# EasyEDA Pro project Jalousee PCB.eprj, schematic Jalousee PCB TC118S_5V_1
Create Date: 2023-09-13; Page Name: P2; Project Name: Jalousee PCB; Schematic Name: Jalousee PCB TC118S_5V_1; Update Date: 2023-09-13; Company: EasyEDA.com; Drawed: EasyEDA Pro; Page Size: A4; Part Number: JLCPCB-002; Reviewed: EasyEDA Pro; Version: V0.1
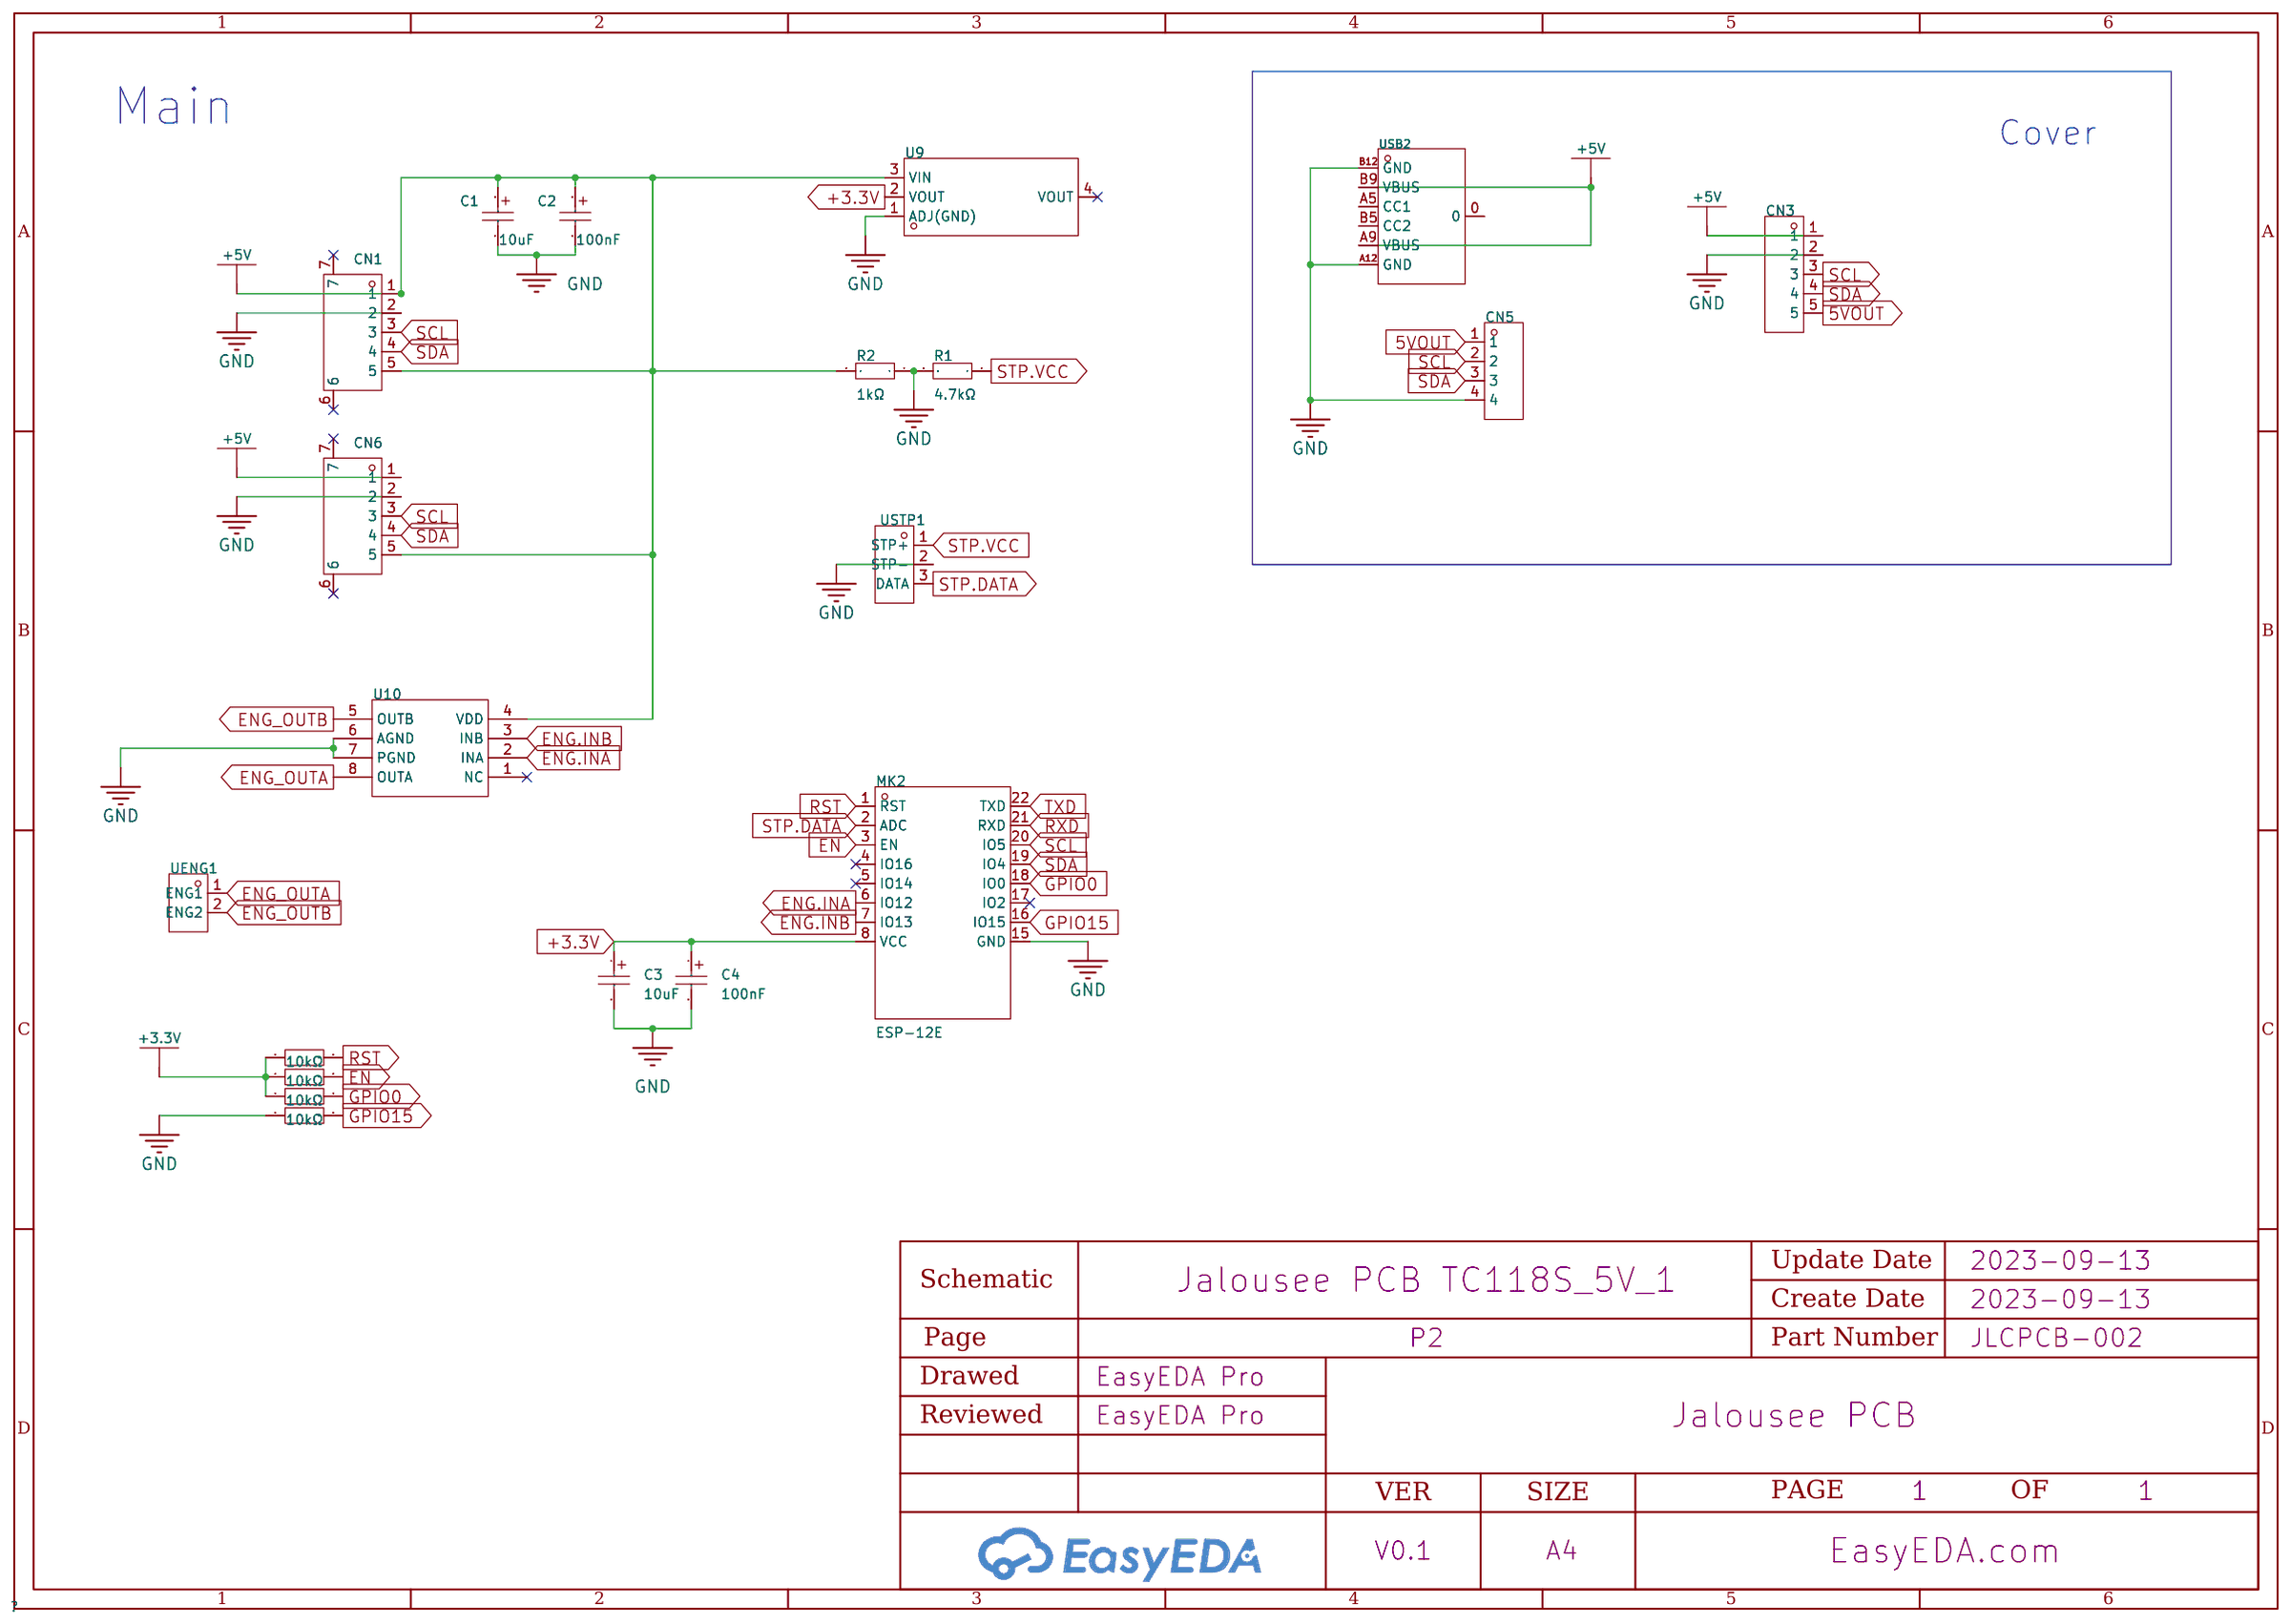
[diagram p6: schematic sheet]

## Parts
C1  10uF  [CASE-A_3216]
C2  100nF  [CASE-A_3216]
C3  10uF  [CASE-A_3216]
C4  100nF  [CASE-A_3216]
CN1  HC-1.25-5PWT  [CONN-SMD_5P-P1.25_HCTL_HC-1.25-5PWT]
CN3  HC-1.25-5A  [CONN-TH_5P-P1.25_HCTL_HC-1.25-5A]
CN5  HC-1.25-4AW  [CONN-TH_4P-P1.25_HCTL_HC-1.25-4AW]
CN6  HC-1.25-5PWT  [CONN-SMD_5P-P1.25_HCTL_HC-1.25-5PWT]
MK2  ESP-12E  [WIFIM-SMD_ESP-12E-BR]
R1  4.7kΩ  [R0603]
R2  1kΩ  [R0603]
R4  10kΩ  [R0603]
R5  10kΩ  [R0603]
R6  10kΩ  [R0603]
R7  10kΩ  [R0603]
U9  -  [SOT-223-3_L6.5-W3.4-P2.30-LS7.0-BR]
U10  -  [SOP-8_L4.9-W3.9-P1.27-LS6.0-BL]
UENG1  -  [CONN-TH_2P-P1.25_HCTL_HC-1.25-2A]
USB2  USB-TYPE-C-015  [USB-C-SMD_TYPE-C--015]
USTP1  -  [CONN-TH_3P-P1.25_HCTL_HC-1.25-3A]

## Library data of the parts
C1 C3 = TAJA106K010RNJ: Capacitance: Tolerance:±10% Tolerance:±10% Rated Voltage: Equivalent Series Resistance(ESR):3Ω@100kHz Operating Temperature:-55~+125 Operating Temperature:-55~+125; LCSC Part Name: 10uF ±10% 10V; Supplier Part: C7177; Manufacturer: Kyocera AVX; JLCPCB Part Class: Extended Part; Datasheet: https://atta.szlcsc.com/upload/public/pdf/source/20160107/1457707748330.pdf; Supplier: LCSC; Tolerance: ±10%; Equivalent Series Resistance(ESR): 3Ω@100kHz; Operating Temperature: -55~+125
C2 C4 = TAJA104K035RNJ: Capacitance: Tolerance:±10% Tolerance:±10% Rated Voltage: Equivalent Series Resistance(ESR):24Ω@100kHz Operating Temperature:-55~+125 Operating Temperature:-55~+125; LCSC Part Name: 100nF ±10% 35V; Supplier Part: C7173; Manufacturer: Kyocera AVX; JLCPCB Part Class: Extended Part; Datasheet: https://atta.szlcsc.com/upload/public/pdf/source/20160107/1457707748183.pdf; Supplier: LCSC; Tolerance: ±10%; Equivalent Series Resistance(ESR): 24Ω@100kHz; Operating Temperature: -55~+125
CN1 CN6 = HC-1.25-5PWT: Reference Series:- Pitch:1.25mm Pins Structure:1x5P Number of Rows:1 Number of PINs Per Row:5 Row Spacing:- Gender:公型插针 Mounting Style:Surface Mount Current Rating (Max):1A Operating Temperature Range:-25℃~+85℃ Operating Temperature Range:-25℃~+85℃; LCSC Part Name: 1.25mm 1x5P 卧贴; Supplier Part: C2845382; Manufacturer: HCTL(华灿天禄); Supplier Footprint: SMD,P=1.25mm; JLCPCB Part Class: Extended Part; Datasheet: https://atta.szlcsc.com/upload/public/pdf/source/20210728/C2845379_48B7DC28A4B35DB030A7253F7C3FD974.pdf; Supplier: LCSC; Pitch: 1.25mm; Pins Structure: 1x5P; Number of Rows: 1; Number of PINs Per Row: 5; Gender: 公型插针; Mounting Style: Surface Mount; Current Rating (Max): 1A; Operating Temperature Range: -25℃~+85℃
CN3 = HC-1.25-5A: Reference Series:- Pitch:1.25mm Pins Structure:1x5P Number of Rows:1 Number of PINs Per Row:5 Row Spacing:- Gender:公型插针 Mounting Style:Straight Current Rating (Max):1A Operating Temperature Range:-25℃~+85℃ Operating Temperature Range:-25℃~+85℃; LCSC Part Name: 1.25mm 1x5P 直插; Supplier Part: C2845523; Manufacturer: HCTL(华灿天禄); Supplier Footprint: 直插,P=1.25mm; JLCPCB Part Class: Extended Part; Datasheet: https://atta.szlcsc.com/upload/public/pdf/source/20210729/C2845520_89EAA22C8D4DE2FB8A253230326912FB.pdf; Supplier: LCSC; Pitch: 1.25mm; Pins Structure: 1x5P; Number of Rows: 1; Number of PINs Per Row: 5; Gender: 公型插针; Mounting Style: Straight; Current Rating (Max): 1A; Operating Temperature Range: -25℃~+85℃
CN5 = HC-1.25-4AW: Reference Series:- Pitch:1.25mm Pins Structure:1x4P Number of Rows:1 Number of PINs Per Row:4 Row Spacing:- Gender:公型插针 Mounting Style:Shrouded Current Rating (Max):1A Operating Temperature Range:-25℃~+85℃ Operating Temperature Range:-25℃~+85℃; LCSC Part Name: 1.25mm 1x4P 弯插; Supplier Part: C2845537; Manufacturer: HCTL(华灿天禄); Supplier Footprint: 插件,P=1.25mm; JLCPCB Part Class: Extended Part; Datasheet: https://atta.szlcsc.com/upload/public/pdf/source/20210729/C2845535_17B4C65D5133EDBE0A07B8E05D9E3662.pdf; Supplier: LCSC; Pitch: 1.25mm; Pins Structure: 1x4P; Number of Rows: 1; Number of PINs Per Row: 4; Gender: 公型插针; Mounting Style: Shrouded; Current Rating (Max): 1A; Operating Temperature Range: -25℃~+85℃
MK2 = ESP-12E_C89297: Supplier Part: C89297; Manufacturer: Ai-Thinker(安信可); Supplier Footprint: 无线模块(WIFI); JLCPCB Part Class: Extended Part; Datasheet: https://atta.szlcsc.com/upload/public/pdf/source/20161125/1480068346912.pdf; Supplier: LCSC
R1 = RC0603JR-074K7L: Overload Voltage (Max): Operating Temperature Range: Operating Temperature Range: Body Length:- Tolerance: φD:- Body Height:- Body Width:- Resistance: Type:Thick Film Resistors Temperature Coefficient: Temperature Coefficient: Power(Watts):; LCSC Part Name: 4.7kΩ ±5%; Supplier Part: C105428; Manufacturer: YAGEO(国巨); Supplier Footprint: 0603; JLCPCB Part Class: Extended Part; Datasheet: https://atta.szlcsc.com/upload/public/pdf/source/20170413/1492062713212.pdf; Supplier: LCSC; Type: Thick Film Resistors
R2 = RC0603FR-071KL: Type:Thick Film Resistors Resistance: Tolerance:±1% Tolerance:±1% Power(Watts): Temperature Coefficient:±100ppm/ Temperature Coefficient:±100ppm/ Overload Voltage (Max): Operating Temperature Range:-55~+155 Operating Temperature Range:-55~+155; LCSC Part Name: 1kΩ ±1% 100mW; Supplier Part: C22548; Manufacturer: YAGEO(国巨); Supplier Footprint: 0603; JLCPCB Part Class: Extended Part; Datasheet: https://atta.szlcsc.com/upload/public/pdf/source/20180312/7BD3618A8B6324EA6280B0497A051AB7.pdf; Supplier: LCSC; Type: Thick Film Resistors; Tolerance: ±1%; Temperature Coefficient: ±100ppm/; Operating Temperature Range: -55~+155
R4-R7 = RC0603JR-0710KL: Overload Voltage (Max): Resistance: Body Length:- Tolerance: φD:- Body Height:- Body Width:- Type:Thick Film Resistors Temperature Coefficient: Temperature Coefficient: Operating Temperature Range: Operating Temperature Range: Power(Watts):; LCSC Part Name: 10kΩ ±5%; Supplier Part: C99198; Manufacturer: YAGEO(国巨); Supplier Footprint: 0603; JLCPCB Part Class: Extended Part; Datasheet: https://atta.szlcsc.com/upload/public/pdf/source/20181223/C99198_917934A193F41F77D9F7D214A8C79116.pdf; Supplier: LCSC; Type: Thick Film Resistors
U9 = AMS1117-3.3: Output Type:固定 Output Polarity:正 Number of Outputs:1 Maximum Input Voltage:18V Output Voltage:3.3V Output Voltage:3.3V Dropout Voltage:1.3V@(1A) Output Current:1A Power Supply Rejection Ratio (PSRR):60dB@(120Hz) Operating Temperature:±150@(Tj) Operating; LCSC Part Name: Vin=18V Vout=3.3V 1A 60dB@(120Hz); Supplier Part: C2891839; Manufacturer: YONGYUTAI(永裕泰); Supplier Footprint: SOT-223; JLCPCB Part Class: Extended Part; Datasheet: https://atta.szlcsc.com/upload/public/pdf/source/20210901/A75ADDE6A17DEE0002F2A58A8D1F3634.pdf; Supplier: LCSC; Output Type: 固定; Output Polarity: 正; Number of Outputs: 1; Maximum Input Voltage: 18V; Output Voltage: 3.3V; Dropout Voltage: 1.3V@(1A); Output Current: 1A; Power Supply Rejection Ratio (PSRR): 60dB@(120Hz); Operating Temperature: ±150@(Tj)
U10 = TC118S: Supplier Part: C88308; Manufacturer: FM富满; Supplier Footprint: SOP-8_150mil; JLCPCB Part Class: Extended Part; Datasheet: https://atta.szlcsc.com/upload/public/pdf/source/20161129/1480413782462.pdf; Supplier: LCSC
UENG1 = HC-1.25-2A: Reference Series:- Pitch:1.25mm Pins Structure:1x2P Number of Rows:1 Number of PINs Per Row:2 Row Spacing:- Gender:公型插针 Mounting Style:直插 Current Rating (Max):1A Operating Temperature Range:-25~+85 Operating Temperature Range:-25~+85; LCSC Part Name: 2P 间距P=1.25mm; Supplier Part: C2845520; Manufacturer: HCTL(华灿天禄); Supplier Footprint: 插件,P=1.25mm; JLCPCB Part Class: Extended Part; Datasheet: https://atta.szlcsc.com/upload/public/pdf/source/20210729/C2845520_89EAA22C8D4DE2FB8A253230326912FB.pdf; Supplier: LCSC; Pitch: 1.25mm; Pins Structure: 1x2P; Number of Rows: 1; Number of PINs Per Row: 2; Gender: 公型插针; Mounting Style: 直插; Current Rating (Max): 1A; Operating Temperature Range: -25~+85
USB2 = USB-TYPE-C-015: Connector Type:Type-C Standard:- Gender:Female Number of Contacts:6P Number of Ports:1 Mounting Style:Brick nogging Current Rating - Power (Max):3A Operating Temperature Range:-25℃~+85℃ Operating Temperature Range:-25℃~+85℃; LCSC Part Name: Type-C 母座 立贴 立贴; Supplier Part: C2927035; Manufacturer: DEALON(德艺隆); Supplier Footprint: SMD; JLCPCB Part Class: Extended Part; Datasheet: https://atta.szlcsc.com/upload/public/pdf/source/20211217/E01574439A69546B11C902AF66442695.pdf; Supplier: LCSC; Connector Type: Type-C; Gender: Female; Number of Contacts: 6P; Number of Ports: 1; Mounting Style: Brick nogging; Current Rating - Power (Max): 3A; Operating Temperature Range: -25℃~+85℃
USTP1 = HC-1.25-3A: Reference Series:- Pitch:1.25mm Pins Structure:1x3P Number of Rows:1 Number of PINs Per Row:3 Row Spacing:- Gender:公型插针 Mounting Style:直插 Current Rating (Max):1A Operating Temperature Range:-25~+85 Operating Temperature Range:-25~+85; LCSC Part Name: 3P 间距P=1.25mm; Supplier Part: C2845521; Manufacturer: HCTL(华灿天禄); Supplier Footprint: 插件,P=1.25mm; JLCPCB Part Class: Extended Part; Datasheet: https://atta.szlcsc.com/upload/public/pdf/source/20210729/C2845520_89EAA22C8D4DE2FB8A253230326912FB.pdf; Supplier: LCSC; Pitch: 1.25mm; Pins Structure: 1x3P; Number of Rows: 1; Number of PINs Per Row: 3; Gender: 公型插针; Mounting Style: 直插; Current Rating (Max): 1A; Operating Temperature Range: -25~+85

## Nets
5VOUT: CN3.5 CN5.1
+3.3V: C3.1 C4.1 MK2.8(VCC) R4.1 R5.1 R6.1 U9.2(VOUT)
+5V: C1.1 C2.1 CN1.1 CN1.5 CN3.1 CN6.1 CN6.5 R2.2 U9.3(VIN) U10.4(VDD) USB2.A9(VBUS) USB2.B9(VBUS)
GND: C1.2 C2.2 C3.2 C4.2 CN1.2 CN3.2 CN5.4 CN6.2 MK2.15(GND) R1.2 R2.1 R7.1 U9.1(ADJ(GND)) U10.6(AGND) U10.7(PGND) USB2.A12(GND) USB2.B12(GND) USTP1.2(STP-)
EN: MK2.3(EN) R6.2
ENG.INA: MK2.6(IO12) U10.2(INA)
ENG.INB: MK2.7(IO13) U10.3(INB)
ENG_OUTA: U10.8(OUTA) UENG1.1(ENG1)
ENG_OUTB: U10.5(OUTB) UENG1.2(ENG2)
GPIO0: MK2.18(IO0) R4.2
GPIO15: MK2.16(IO15) R7.2
RST: MK2.1(RST) R5.2
RXD: MK2.21(RXD)
SCL: CN1.3 CN3.3 CN5.2 CN6.3 MK2.20(IO5)
SDA: CN1.4 CN3.4 CN5.3 CN6.4 MK2.19(IO4)
STP.DATA: MK2.2(ADC) USTP1.3(DATA)
STP.VCC: R1.1 USTP1.1(STP+)
TXD: MK2.22(TXD)

Not connected (* = marked no-connect by the designer): CN1 6* 7*; CN6 6* 7*; MK2 4(IO16)* 5(IO14)* 17(IO2)*; U9 4(VOUT)*; U10 1(NC)*; USB2 0 A5(CC1) B5(CC2)

## Notes on the sheet
- Main
- Cover
